# EAGLE design henryfc v2 (EAGLE 9.6.2)
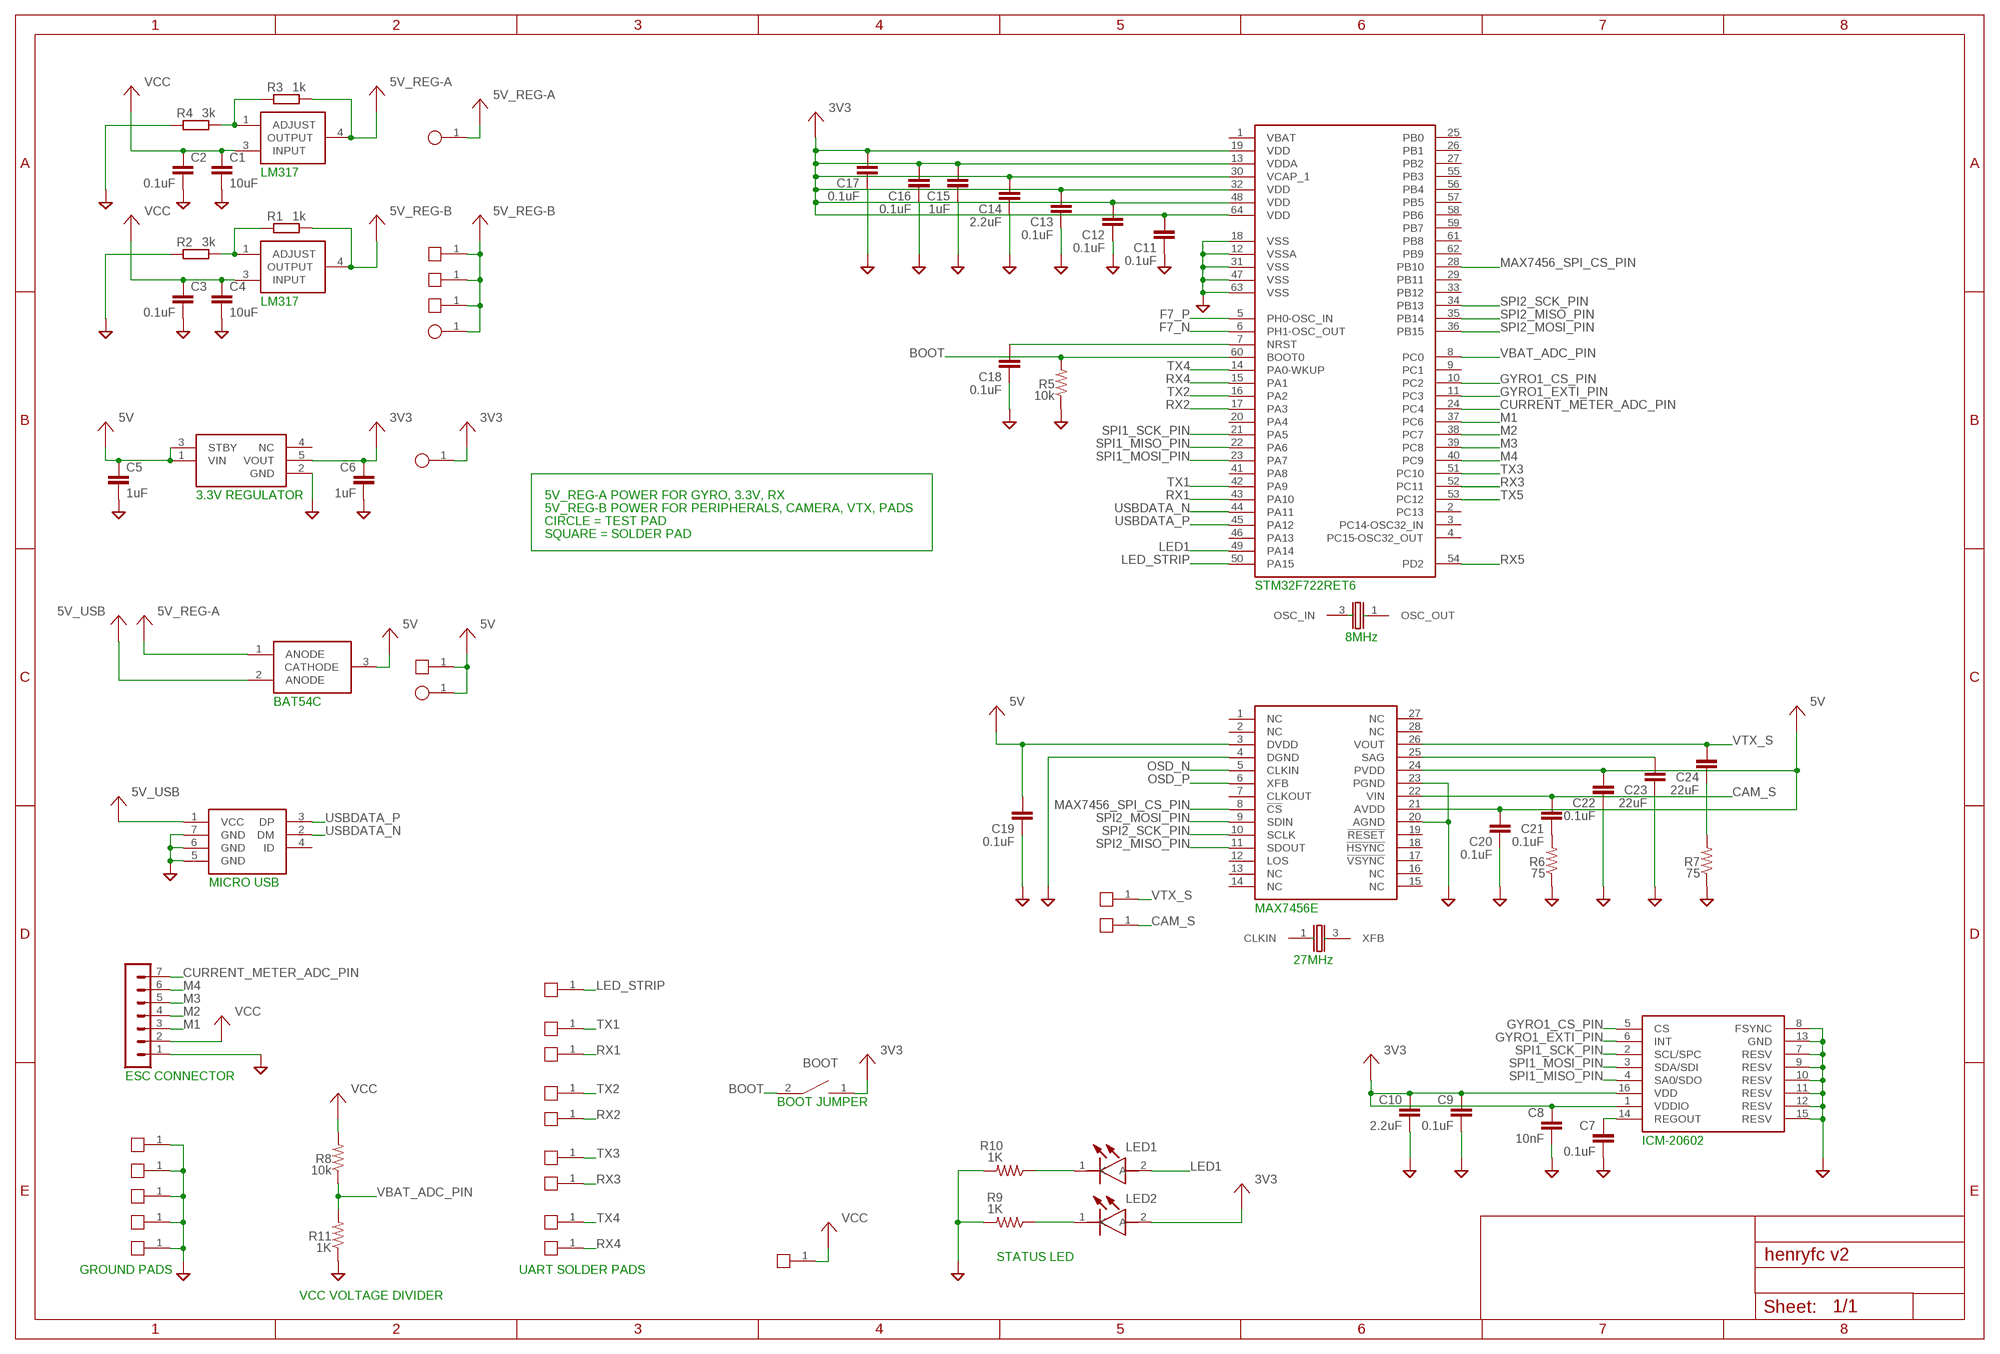
[diagram p0: schematic, sheet 1]

## Parts
C1  10uF  C-EUC0603  [C0603]
C2  0.1uF  C-EUC0603  [C0603]
C3  0.1uF  C-EUC0603  [C0603]
C4  10uF  C-EUC0603  [C0603]
C5  1uF  C-EUC0603  [C0603]
C6  1uF  C-EUC0603  [C0603]
C7  0.1uF  C-EUC0402  [C0402]
C8  10nF  C-EUC0402  [C0402]
C9  0.1uF  C-EUC0402  [C0402]
C10  2.2uF  C-EUC0402  [C0402]
C11  0.1uF  C-EUC0402  [C0402]
C12  0.1uF  C-EUC0402  [C0402]
C13  0.1uF  C-EUC0402  [C0402]
C14  2.2uF  C-EUC0402  [C0402]
C15  1uF  C-EUC0402  [C0402]
C16  0.1uF  C-EUC0402  [C0402]
C17  0.1uF  C-EUC0402  [C0402]
C18  0.1uF  C-EUC0402  [C0402]
C19  0.1uF  C-EUC0402  [C0402]
C20  0.1uF  C-EUC0402  [C0402]
C21  0.1uF  C-EUC0402  [C0402]
C22  0.1uF  C-EUC0402  [C0402]
C23  22uF  C-EUC0402  [C0402]
C24  22uF  C-EUC0402  [C0402]
LED1  KB_DELPS2.12-QHRI-24-Z555-10-S  [KBDELPS212QHRI24Z55510S]
LED2  KR_DELPS1.22-UHVI-26-H3Q4  [KRDELPS122UHVI26H3Q4]
R1  1k  R-EU_R0603  [R0603]
R2  3k  R-EU_R0603  [R0603]
R3  1k  R-EU_R0603  [R0603]
R4  3k  R-EU_R0603  [R0603]
R5  10k  R-US_R0402  [R0402]
R6  75  R-US_R0402  [R0402]
R7  75  R-US_R0402  [R0402]
R8  10k  R-US_R0402  [R0402]
R9  1K  R-US_R0402  [R0402]
R10  1K  R-US_R0402  [R0402]
R11  1K  R-US_R0402  [R0402]
TP1  TESTPOINT  [TESTPOINT]
TP2  TESTPOINT  [TESTPOINT]
TP3  TESTPOINT  [TESTPOINT]
TP4  TESTPOINT  [TESTPOINT]
U$1  BAT54C  [SOT-23]
U$2  BUXXSD5WG-3.3V-LDO  [SSOP5]
U$3  LM317DCYR  [SOT-223]
U$4  LM317DCYR  [SOT-223]
U$5  STM32F722  [LQFP64]
U$6  MICRO-USB  [MICRO-USB]
U$7  MAX7456  [SSOP28]
U$8  ICM-20602  [LGA16-3X3]
U$9  ECX-32-8MHZ  [ECX-32-XTAL]
U$10  NX3225GA-27MHZ  [3.2X2.5-XTAL]
U$11  BOOT_JUMPER  [BOOT_JUMPER]
U$13  SOLDERPAD  [SOLDERPAD]
U$14  SOLDERPAD  [SOLDERPAD]
U$15  SOLDERPAD  [SOLDERPAD]
U$19  SOLDERPAD  [SOLDERPAD]
U$20  SOLDERPAD  [SOLDERPAD]
U$21  SOLDERPAD  [SOLDERPAD]
U$22  SOLDERPAD  [SOLDERPAD]
U$23  SOLDERPAD  [SOLDERPAD]
U$24  SOLDERPAD  [SOLDERPAD]
U$25  SOLDERPAD  [SOLDERPAD]
U$26  SOLDERPAD  [SOLDERPAD]
U$27  SOLDERPAD  [SOLDERPAD]
U$28  SOLDERPAD  [SOLDERPAD]
U$29  SOLDERPAD  [SOLDERPAD]
U$30  SOLDERPAD  [SOLDERPAD]
U$31  SOLDERPAD  [SOLDERPAD]
U$32  SOLDERPAD  [SOLDERPAD]
U$33  SOLDERPAD  [SOLDERPAD]
U$34  SOLDERPAD  [SOLDERPAD]
U$35  SOLDERPAD  [SOLDERPAD]
U$36  SOLDERPAD  [SOLDERPAD]
U$37  POWER  (no package)
U$38  POWER  (no package)
U$39  POWER  (no package)
U$40  POWER  (no package)
U$41  POWER  (no package)
U$42  POWER  (no package)
U$43  POWER  (no package)
U$44  POWER  (no package)
U$45  POWER  (no package)
U$46  POWER  (no package)
U$47  POWER  (no package)
U$48  POWER  (no package)
U$49  POWER  (no package)
U$50  POWER  (no package)
U$51  POWER  (no package)
U$52  POWER  (no package)
U$53  POWER  (no package)
U$54  POWER  (no package)
U$55  POWER  (no package)
U$56  POWER  (no package)
U$57  POWER  (no package)
U$58  POWER  (no package)
U$59  POWER  (no package)
X1  SM07B-SRSS-TB  [SM07B-SRSS-TB]

## Nets
3V3: C6.1 C8.1 C9.1 C10.1 C11.1 C12.1 C13.1 C14.1 C15.1 C16.1 C17.1 LED2.2(A) TP2.1( ) U$2.5(VOUT) U$5.13(VDDA) U$5.19(VDD) U$5.30(VCAP_1) U$5.32(VDD) U$5.48(VDD) U$5.64(VDD) U$8.1(VDDIO) U$8.16(VDD) U$11.1(  ) U$37.   U$41.   U$53.   U$54.   U$56.   U$59.  
5V: C5.1 C19.1 C20.1 C22.1 TP1.1( ) U$1.3(CATHODE) U$2.1(VIN) U$2.3(STBY) U$7.3(DVDD) U$7.21(AVDD) U$7.24(PVDD) U$15.1( ) U$38.   U$42.   U$50.   U$57.   U$58.  
5V_REG-A: R3.2 TP4.1( ) U$1.1(ANODE) U$4.4(OUTPUT) U$44.   U$46.   U$51.  
5V_REG-B: R1.2 TP3.1( ) U$3.4(OUTPUT) U$13.1( ) U$14.1( ) U$25.1( ) U$43.   U$47.  
5V_USB: U$1.2(ANODE) U$6.1(VCC) U$49.   U$52.  
BOOT: R5.2 U$5.60(BOOT0) U$11.2( )
CAM_S: C21.1 U$7.22(VIN) U$31.1( )
CURRENT_METER_ADC_PIN: U$5.24(PC4) X1.7
F7_N: U$5.6(PH1-OSC_OUT) U$9.1(OSC_OUT)
F7_P: U$5.5(PH0-OSC_IN) U$9.3(OSC_IN)
GND: C1.2 C2.2 C3.2 C4.2 C5.2 C6.2 C7.2 C8.2 C9.2 C10.2 C11.2 C12.2 C13.2 C14.2 C15.2 C16.2 C17.2 C18.2 C19.2 C20.2 C22.2 C23.2 R2.1 R4.1 R5.1 R6.1 R7.1 R9.2 R10.2 R11.1 U$2.2(GND) U$5.12(VSSA) U$5.18(VSS) U$5.31(VSS) U$5.47(VSS) U$5.63(VSS) U$6.5(GND) U$6.6(GND) U$6.7(GND) U$7.4(DGND) U$7.20(AGND) U$7.23(PGND) U$8.7(RESV) U$8.8(FSYNC) U$8.9(RESV) U$8.10(RESV) U$8.11(RESV) U$8.12(RESV) U$8.13(GND) U$8.15(RESV) U$19.1( ) U$20.1( ) U$21.1( ) U$27.1( ) U$35.1( ) X1.1
GYRO1_CS_PIN: U$5.10(PC2) U$8.5(CS)
GYRO1_EXTI_PIN: U$5.11(PC3) U$8.6(INT)
LED1: LED1.2(A) U$5.49(PA14)
LED_STRIP: U$5.50(PA15) U$23.1( )
M1: U$5.37(PC6) X1.3
M2: U$5.38(PC7) X1.4
M3: U$5.39(PC8) X1.5
M4: U$5.40(PC9) X1.6
MAX7456_SPI_CS_PIN: U$5.28(PB10) U$7.8(!CS)
N$1: R1.1 R2.2 U$3.1(ADJUST)
N$2: R3.1 R4.2 U$4.1(ADJUST)
N$3: C18.1 U$5.7(NRST)
N$7: C23.1 U$7.25(SAG)
N$9: C21.2 R6.2
N$10: C7.1 U$8.14(REGOUT)
N$11: C24.2 R7.2
N$14: LED1.1(K) R10.1
N$15: LED2.1(K) R9.1
OSD_N: U$7.5(CLKIN) U$10.1(CLKIN)
OSD_P: U$7.6(XFB) U$10.3(XFB)
RX1: U$5.43(PA10) U$34.1( )
RX2: U$5.17(PA3) U$24.1( )
RX3: U$5.52(PC11) U$28.1( )
RX4: U$5.15(PA1) U$32.1( )
RX5: U$5.54(PD2)
SPI1_MISO_PIN: U$5.22(PA6) U$8.4(SA0/SDO)
SPI1_MOSI_PIN: U$5.23(PA7) U$8.3(SDA/SDI)
SPI1_SCK_PIN: U$5.21(PA5) U$8.2(SCL/SPC)
SPI2_MISO_PIN: U$5.35(PB14) U$7.11(SDOUT)
SPI2_MOSI_PIN: U$5.36(PB15) U$7.9(SDIN)
SPI2_SCK_PIN: U$5.34(PB13) U$7.10(SCLK)
TX1: U$5.42(PA9) U$36.1( )
TX2: U$5.16(PA2) U$22.1( )
TX3: U$5.51(PC10) U$26.1( )
TX4: U$5.14(PA0-WKUP) U$30.1( )
TX5: U$5.53(PC12)
USBDATA_N: U$5.44(PA11) U$6.2(DM)
USBDATA_P: U$5.45(PA12) U$6.3(DP)
VBAT_ADC_PIN: R8.1 R11.2 U$5.8(PC0)
VCC: C1.1 C2.1 C3.1 C4.1 R8.2 U$3.3(INPUT) U$4.3(INPUT) U$33.1( ) U$39.   U$40.   U$45.   U$48.   U$55.   X1.2
VTX_S: C24.1 U$7.26(VOUT) U$29.1( )
Unconnected: U$2.4(NC) U$5.1(VBAT) U$5.2(PC13) U$5.3(PC14-OSC32_IN) U$5.4(PC15-OSC32_OUT) U$5.9(PC1) U$5.20(PA4) U$5.25(PB0) U$5.26(PB1) U$5.27(PB2) U$5.29(PB11) U$5.33(PB12) U$5.41(PA8) U$5.46(PA13) U$5.55(PB3) U$5.56(PB4) U$5.57(PB5) U$5.58(PB6) U$5.59(PB7) U$5.61(PB8) U$5.62(PB9) U$6.4(ID) U$7.1(NC) U$7.2(NC) U$7.7(CLKOUT) U$7.12(LOS) U$7.13(NC) U$7.14(NC) U$7.15(NC) U$7.16(NC) U$7.17(!VSYNC) U$7.18(!HSYNC) U$7.19(!RESET) U$7.27(NC) U$7.28(NC)

## Notes on the sheet
- LM317
- LM317
- 3.3V REGULATOR | 5V_REG-A POWER FOR GYRO, 3.3V, RX
- 5V_REG-B POWER FOR PERIPHERALS, CAMERA, VTX, PADS
- CIRCLE = TEST PAD
- SQUARE = SOLDER PAD
- STM32F722RET6
- 8MHz
- BAT54C
- MICRO USB
- MAX7456E
- 27MHz
- ESC CONNECTOR
- BOOT JUMPER
- ICM-20602
- STATUS LED
- GROUND PADS | UART SOLDER PADS
- VCC VOLTAGE DIVIDER

## Library data of the parts
C1-C24 = rcl:C-EU: CAPACITOR, European symbol; SPICEPREFIX: C
LED1 = SamacSys_Parts:KB_DELPS2.12-QHRI-24-Z555-10-S: Standard LEDs - SMD Blue TOPLED E 1608 Source: Datasheet <https://www.mouser.in/ProductDetail/OSRAM-Opto-Semiconductors/KB-DELPS212-QHRI-24-Z555-10-S?qs=/ha2pyFaduguGXnxUQPQvOwqvA0l1GbBGsJPdL2BNxwU00XGTd8yf8CXZb0fb41Mz9FjufZkGgQ=>; ARROW_PART_NUMBER: KB DELPS2.12-QHRI-24-Z555-10-S; DESCRIPTION: Standard LEDs - SMD Blue TOPLED E 1608; HEIGHT: mm; MANUFACTURER_NAME: OSRAM; MANUFACTURER_PART_NUMBER: KB DELPS2.12-QHRI-24-Z555-10-S; MOUSER_PART_NUMBER: 720-KBDELPS212A6350; MOUSER_PRICE-STOCK: https://www.mouser.co.uk/ProductDetail/OSRAM-Opto-Semiconductors/KB-DELPS212-QHRI-24-Z555-10-S?qs=OTrKUuiFdkb2rezknsx9mQ%3D%3D
LED2 = SamacSys_Parts:KR_DELPS1.22-UHVI-26-H3Q4: Standard LEDs - SMD Red TOPLED E 1608 Source: Datasheet <https://www.mouser.co.uk/ProductDetail/OSRAM-Opto-Semiconductors/KR-DELPS122-UHVI-26-H3Q4?qs=sGAEpiMZZMseGfSY3csMkXiJOH5X%2BfXw4kv80xILcLqjWCSyCkalLg==>; ARROW_PART_NUMBER: KR DELPS1.22-UHVI-26-H3Q4; DESCRIPTION: Standard LEDs - SMD Red TOPLED E 1608; HEIGHT: mm; MANUFACTURER_NAME: OSRAM; MANUFACTURER_PART_NUMBER: KR DELPS1.22-UHVI-26-H3Q4; MOUSER_PART_NUMBER: 720-KRDELPS122A5163; MOUSER_PRICE-STOCK: https://www.mouser.co.uk/ProductDetail/OSRAM-Opto-Semiconductors/KR-DELPS122-UHVI-26-H3Q4?qs=XeJtXLiO41Rxc1kIEv94zQ%3D%3D
R1-R4 = rcl:R-EU_: RESISTOR, European symbol; SPICEPREFIX: R
R5-R11 = rcl:R-US_: RESISTOR, American symbol; SPICEPREFIX: R
TP1-TP4 = HenryFC:TESTPOINT
U$1 = HenryFC:BAT54C
U$2 = HenryFC:BUXXSD5WG-3.3V-LDO
U$3 U$4 = HenryFC:LM317DCYR
U$5 = HenryFC:STM32F722
U$6 = HenryFC:MICRO-USB
U$7 = HenryFC:MAX7456
U$8 = HenryFC:ICM-20602
U$9 = HenryFC:ECX-32-8MHZ
U$10 = HenryFC:NX3225GA-27MHZ
U$11 = HenryFC:BOOT_JUMPER
U$13-U$15 U$19-U$36 = HenryFC:SOLDERPAD
U$37-U$59 = HenryFC:POWER
X1 = con-jst:SM07B-SRSS: JST SH series header 1.00mm pitch disconnectable crimp style connectors, horizontal (side entry type), 7 pins

## Board
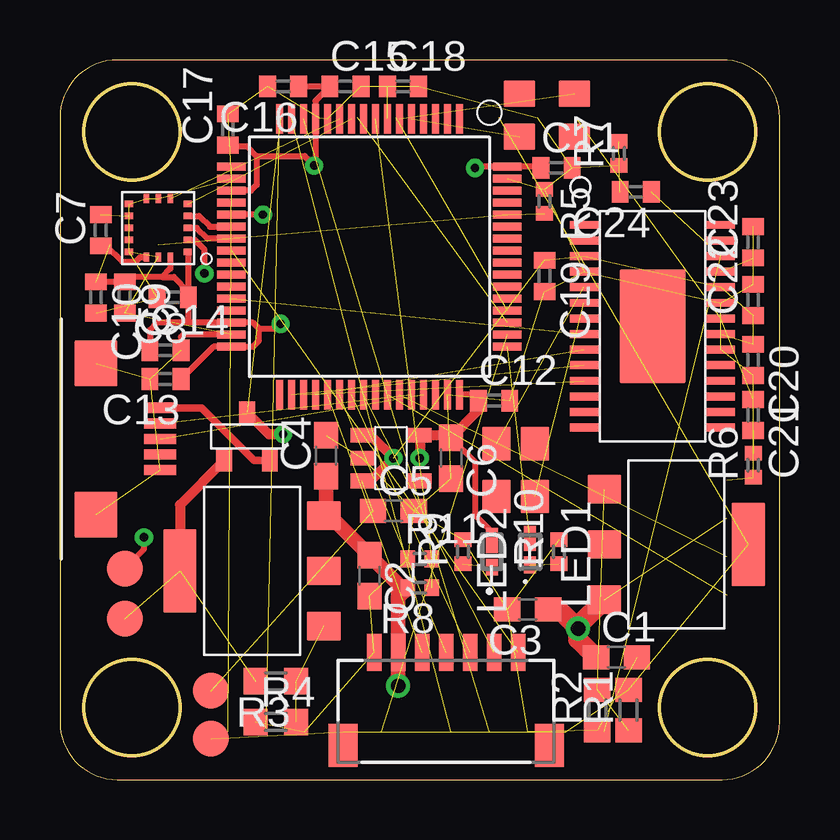
[diagram p1: board, top side]
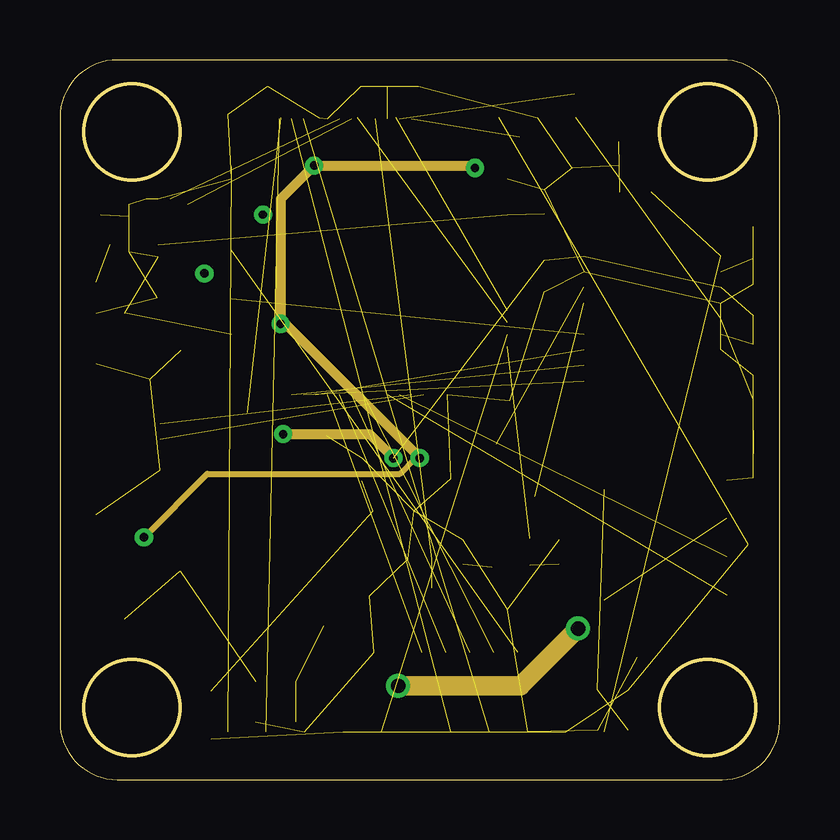
[diagram p2: board, inner layer Route15]
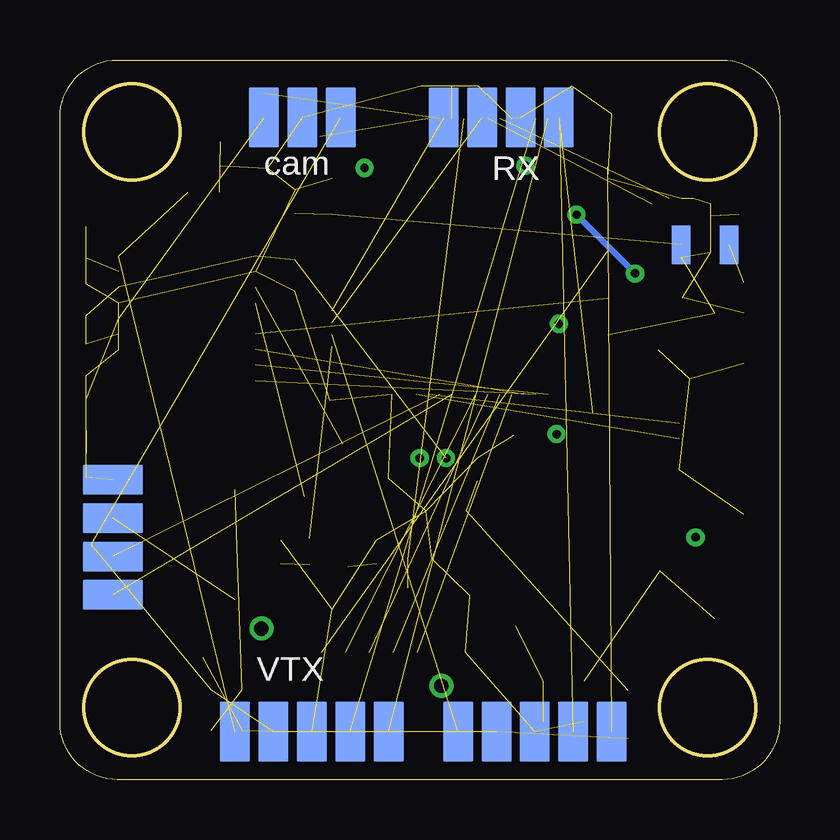
[diagram p3: board, bottom side, seen from below]

Size 30 x 30 mm. Coordinates in mm from the lower left corner, seen from the top.
Outline: 30,2.39 30,27.61 arc90 27.61,30 2.39,30 arc90 0,27.61 0,2.39 arc90 2.39,0 27.61,0 arc90 30,2.39
Outline: circle at 27,3 radius 2
Outline: circle at 3,3 radius 2
Outline: circle at 3,27 radius 2
Outline: circle at 27,27 radius 2
Copper layers (1+2*15+16): Top 0.035mm / dielectric 1.5mm / Route2 0.035mm / dielectric 0.15mm / Route15 0.035mm / dielectric 0.2mm / Bottom 0.035mm
Design rules "default *": minimum track width 6mil, minimum drill 0.35mm, track to track 6mil, track to pad 6mil, pad to pad 6mil, via to via 6mil, smd to smd 6mil, copper to edge 15mil, drill to drill 6mil, minimum pad ring 10mil, minimum via ring 8mil, stop-mask expansion 4mil, vias tented up to drill 0mil, thermal gap 10mil

### Footprints (pad centres in the part's own frame; a part is rotated, then mirrored left to right if it is on the bottom)
C0603 = smd 1.1 x 1: 1 -0.85,0; 2 0.85,0
C0402 = smd 0.7 x 0.9: 1 -0.65,0; 2 0.65,0
KBDELPS212QHRI24Z55510S = smd 0.7 x 0.5: 1 -0.558,0 | smd 1.05 x 0.5: 2 0.558,0
KRDELPS122UHVI26H3Q4 = smd 0.7 x 0.5: 1 -0.645,0 | smd 1.05 x 0.5: 2 0.47,0
R0603 = smd 1 x 1.1: 1 -0.85,0; 2 0.85,0
R0402 = smd 0.6 x 0.7: 1 -0.5,0; 2 0.5,0
TESTPOINT = smd 1.5 x 1.5: 1 0,0
SOT-23 = smd 0.7 x 0.9: 1 -0.95,-1; 2 0.95,-1; 3 0,1
SSOP5 = smd 0.6 x 1: 1 -0.95,-1.2; 2 0,-1.2; 3 0.95,-1.2; 4 0.95,1.2; 5 -0.95,1.2
SOT-223 = smd 1.2 x 1.4: 1 -2.3,-3; 2 0,-3; 3 2.3,-3 | smd 3.5 x 1.4: 4 0,3
LQFP64 = smd 0.3 x 1.2: 1 -3.75,-5.75; 2 -3.25,-5.75; 3 -2.75,-5.75; 4 -2.25,-5.75; 5 -1.75,-5.75; 6 -1.25,-5.75; 7 -0.75,-5.75; 8 -0.25,-5.75; 9 0.25,-5.75; 10 0.75,-5.75; 11 1.25,-5.75; 12 1.75,-5.75; 13 2.25,-5.75; 14 2.75,-5.75; 15 3.25,-5.75; 16 3.75,-5.75; 33 3.75,5.75; 34 3.25,5.75; 35 2.75,5.75; 36 2.25,5.75; 37 1.75,5.75; 38 1.25,5.75; 39 0.75,5.75; 40 0.25,5.75; 41 -0.25,5.75; 42 -0.75,5.75; 43 -1.25,5.75; 44 -1.75,5.75; 45 -2.25,5.75; 46 -2.75,5.75; 47 -3.25,5.75; 48 -3.75,5.75 | smd 1.2 x 0.3: 17 5.75,-3.75; 18 5.75,-3.25; 19 5.75,-2.75; 20 5.75,-2.25; 21 5.75,-1.75; 22 5.75,-1.25; 23 5.75,-0.75; 24 5.75,-0.25; 25 5.75,0.25; 26 5.75,0.75; 27 5.75,1.25; 28 5.75,1.75; 29 5.75,2.25; 30 5.75,2.75; 31 5.75,3.25; 32 5.75,3.75; 49 -5.75,3.75; 50 -5.75,3.25; 51 -5.75,2.75; 52 -5.75,2.25; 53 -5.75,1.75; 54 -5.75,1.25; 55 -5.75,0.75; 56 -5.75,0.25; 57 -5.75,-0.25; 58 -5.75,-0.75; 59 -5.75,-1.25; 60 -5.75,-1.75; 61 -5.75,-2.25; 62 -5.75,-2.75; 63 -5.75,-3.25; 64 -5.75,-3.75
MICRO-USB = smd 0.4 x 1.35: 1 -1.3,2.675; 2 -0.65,2.675; 3 0,2.675; 4 0.65,2.675; 5 1.3,2.675 | smd 1.9 x 1.8: 6 -3.15,0; 7 3.15,0
SSOP28 = smd 0.3 x 1.2: 1 -4.225,-2.85; 2 -3.575,-2.85; 3 -2.925,-2.85; 4 -2.275,-2.85; 5 -1.625,-2.85; 6 -0.975,-2.85; 7 -0.325,-2.85; 8 0.325,-2.85; 9 0.975,-2.85; 10 1.625,-2.85; 11 2.275,-2.85; 12 2.925,-2.85; 13 3.575,-2.85; 14 4.225,-2.85; 15 4.225,2.85; 16 3.575,2.85; 17 2.925,2.85; 18 2.275,2.85; 19 1.625,2.85; 20 0.975,2.85; 21 0.325,2.85; 22 -0.325,2.85; 23 -0.975,2.85; 24 -1.625,2.85; 25 -2.275,2.85; 26 -2.925,2.85; 27 -3.575,2.85; 28 -4.225,2.85 | smd 4.75 x 2.74: P$29 0,0
LGA16-3X3 = smd 0.35 x 0.25: 1 -1.225,1; 2 -1.225,0.5; 3 -1.225,0; 4 -1.225,-0.5; 5 -1.225,-1; 9 1.225,-1; 10 1.225,-0.5; 11 1.225,0; 12 1.225,0.5; 13 1.225,1 | smd 0.25 x 0.35: 6 -0.5,-1.225; 7 0,-1.225; 8 0.5,-1.225; 14 0.5,1.225; 15 0,1.225; 16 -0.5,1.225
ECX-32-XTAL = smd 1.3 x 1.1: 1 -1.15,-0.9; 2 1.15,-0.9; 3 1.15,0.9; 4 -1.15,0.9
3.2X2.5-XTAL = smd 1.4 x 1.2: 1 -1.1,-0.8; 2 1.1,-0.8; 3 1.1,0.8; 4 -1.1,0.8
BOOT_JUMPER = smd 1.6 x 0.8: 1 0,1; 2 0,-1
SOLDERPAD = smd 2.5 x 1.25: 1 0,0
SM07B-SRSS-TB = smd 0.6 x 1.55: 1 3,0; 2 2,0; 3 1,0; 4 0,0; 5 -1,0; 6 -2,0; 7 -3,0 | smd 1.2 x 1.8: M1 4.3,3.875; M2 -4.3,3.875

### Placement (x,y rotation side)
C1  23.2,5.1 0 top
C2  12.9,8.5 270 top
C3  19.5,7.1 180 top
C4  11.1,13.5 90 top
C5  13.9,11.2 0 top
C6  16.3,13.4 270 top
C7  1.7,22.9 90 top
C8  4.7,20.1 180 top
C9  2.7,20.1 270 top
C10  1.5,20.1 270 top
C11  20.7,25.5 0 top
C12  18.1,15.8 0 top
C13  4.4,16.7 180 top
C14  4.4,17.9 0 top
C15  11.9,28.9 0 top
C16  9.3,28.9 180 top
C17  7,27.1 90 top
C18  14.3,28.9 0 top
C19  20.2,21 270 top
C20  28.9,17.5 270 top
C21  28.9,15.2 270 top
C22  28.9,20 90 top
C23  28.9,22.4 90 top
C24  24,24.5 180 top
LED1  19.6,9.5 90 top
LED2  18,9.5 90 top
R1  23.7,2.9 90 top
R2  22.4,2.9 90 top
R3  9,4.1 180 top
R4  9,2.4 0 top
R5  20.2,24.1 270 top
R6  28.9,13.1 90 top
R7  23.3,26.1 90 top
R8  15,8 180 top
R9  16.8,9.5 90 top
R10  20.8,9.5 90 top
R11  15,9.2 0 top
TP1  6.3,3.7 0 top
TP2  2.7,8.8 0 top
TP3  6.3,1.7 180 top
TP4  2.7,6.7 0 top
U$1  7.8,14.3 0 top
U$2  13.8,13.4 270 top
U$3  25.7,9.8 270 top
U$4  8,8.7 90 top
U$5  12.9,21.8 180 top
U$6  1.5,14.2 270 top
U$7  24.7,18.9 270 top
U$8  4.1,23 180 top
U$9  20.3,27.7 180 top
U$10  19,12.9 270 top
U$11  3.1,22.3 270 bottom
U$13  18.3,27.6 270 bottom
U$14  21.1,2 270 bottom
U$15  9.2,27.6 270 bottom
U$19  27.8,12.5 0 bottom
U$20  10.2,2 270 bottom
U$21  19.5,2 270 bottom
U$22  8.6,2 270 bottom
U$23  13.4,2 270 bottom
U$24  7,2 270 bottom
U$25  11.8,2 270 bottom
U$26  12.4,27.6 90 bottom
U$27  10.8,27.6 90 bottom
U$28  14,27.6 270 bottom
U$29  22.7,2 270 bottom
U$30  17.9,2 270 bottom
U$31  21.5,27.6 270 bottom
U$32  16.3,2 270 bottom
U$33  27.8,10.9 180 bottom
U$34  27.8,9.3 0 bottom
U$35  19.9,27.6 90 bottom
U$36  27.8,7.7 180 bottom
X1  16.1,5.3 180 top

### Tracks (layer width: path | path; a pad name or v marks a point on that pad's centre or on a via)
3V3  (via drill 0.35)  (1 unrouted)
  Top 0.254: C13.1 6.4,18.05 U$5.32 8.05,18.05 8.3,18.3 8.3,18.8 | C12.1 17.2,16.05 U$5.48 | C11.1 20,25.55 U$5.64 17.35,25.55 v17.3,25.5 | C16.1 C15.1 10.65,28.3 U$5.13 10.65,25.65 v10.6,25.6 10.2,26 8.2,26 | C17.1 7.05,26.4 7.8,26.4 8.2,26 | U$5.19 7.95,24.55 8.2,24.8 8.2,26 | 8.3,18.8 8.05,19.05 U$5.30 5.35,19.05 | C14.1 3.75,18.75 4.05,19.05 5.35,19.05 | 8.3,18.8 9,18.8 v9.2,19 | C6.1 17.32,13.23 17.32,11 18,10.32 LED2.2 | TP2.1 3.5,9.6 v3.5,10.1 | C10.1 C9.1 2.9,20.95 4.25,20.95 | U$8.16 4.6,21.3 4.25,20.95 | U$8.1 5.35,21.98 5.35,20.35 | 5.35,20.35 C8.1 5.35,19.05 | 4.25,20.95 4.75,20.95 5.35,20.35
  Top 0.406: C12.1 17.45,15.4 C6.1 16.2,14.35 U$2.5 v15,13.4 | C14.1 3.75,17.92
  Route15 0.254: v15,13.4 14.83,13.4 14.17,12.74 6.14,12.74 v3.5,10.1
  Route15 0.406: v15,13.4 9.4,19 v9.2,19 9.2,24.2 v10.6,25.6 17.2,25.6 v17.3,25.5
5V  (via drill 0.35)  (9 unrouted)
  Top 0.406: U$1.3 8.7,14.4 v9.3,14.4 | U$2.1 12.95,14.35 v13.9,13.4 12.95,12.45 U$2.3
  Route15 0.406: v9.3,14.4 12.9,14.4 v13.9,13.4
5V_REG-A  (2 unrouted)
  Top 0.406: U$1.1 5,11.45 U$4.4
5V_REG-B  (5 unrouted)
5V_USB
  Top 0.305: U$6.1 5.9,15.5 8.1,13.3 U$1.2
BOOT  (2 unrouted)
CAM_S  (2 unrouted)
CURRENT_METER_ADC_PIN  (1 unrouted)
F7_N  (1 unrouted)
F7_P  (1 unrouted)
GND  (54 unrouted)
  Top 0.254: C14.2 5.05,18.45 5.15,18.55 U$5.31
GYRO1_CS_PIN  (1 unrouted)
GYRO1_EXTI_PIN  (1 unrouted)
LED1  (1 unrouted)
LED_STRIP  (1 unrouted)
M1  (1 unrouted)
M2  (1 unrouted)
M3  (1 unrouted)
M4  (1 unrouted)
MAX7456_SPI_CS_PIN  (1 unrouted)
N$1  (2 unrouted)
N$2  (2 unrouted)
N$3  (1 unrouted)
N$7  (1 unrouted)
N$9  (1 unrouted)
N$10
  Top 0.254: C7.1 1.93,22.25 2.59,21.6 3.16,21.6 3.34,21.77 U$8.14
N$11  (1 unrouted)
N$14  (1 unrouted)
N$15  (1 unrouted)
OSD_N  (1 unrouted)
OSD_P  (1 unrouted)
RX1  (1 unrouted)
RX2  (1 unrouted)
RX3  (1 unrouted)
RX4  (1 unrouted)
SPI1_MISO_PIN
  Top 0.254: U$8.4 5.8,23.5 6.25,23.05 U$5.22
SPI1_MOSI_PIN
  Top 0.254: U$5.23 6.15,22.55 5.7,23 U$8.3
SPI1_SCK_PIN  (via drill 0.35)
  Top 0.254: U$8.2 5.62,22.5 6.02,22.11 v6.02,21.1 | v8.47,23.55 U$5.21
  Bottom 0.254: v6.02,21.1 v8.47,23.55
SPI2_MISO_PIN  (1 unrouted)
SPI2_MOSI_PIN  (1 unrouted)
SPI2_SCK_PIN  (1 unrouted)
TX1  (1 unrouted)
TX2  (1 unrouted)
TX3  (1 unrouted)
TX4  (1 unrouted)
USBDATA_N  (1 unrouted)
USBDATA_P  (1 unrouted)
VBAT_ADC_PIN  (2 unrouted)
VCC  (via drill 0.6)  (1 unrouted)
  Top 0.61: 14.1,6.2 X1.2 | C4.1 11.1,11.1 U$4.3 11.25,11 C2.1 14.1,8.15 14.1,7.6 | X1.2 14.1,7.6 | 14.1,7.6 R8.2 | X1.2 v14.1,3.91
  Top 0.813: U$3.3 21.6,6.4 v21.6,6.3 | C1.1 21.6,5.85 v21.6,6.3 | C3.1 20.8,7.1 v21.6,6.3
  Route15 0.813: v14.1,3.91 19.21,3.91 v21.6,6.3
VTX_S  (2 unrouted)

### Text on the board
bNames: RX | cam | VTX